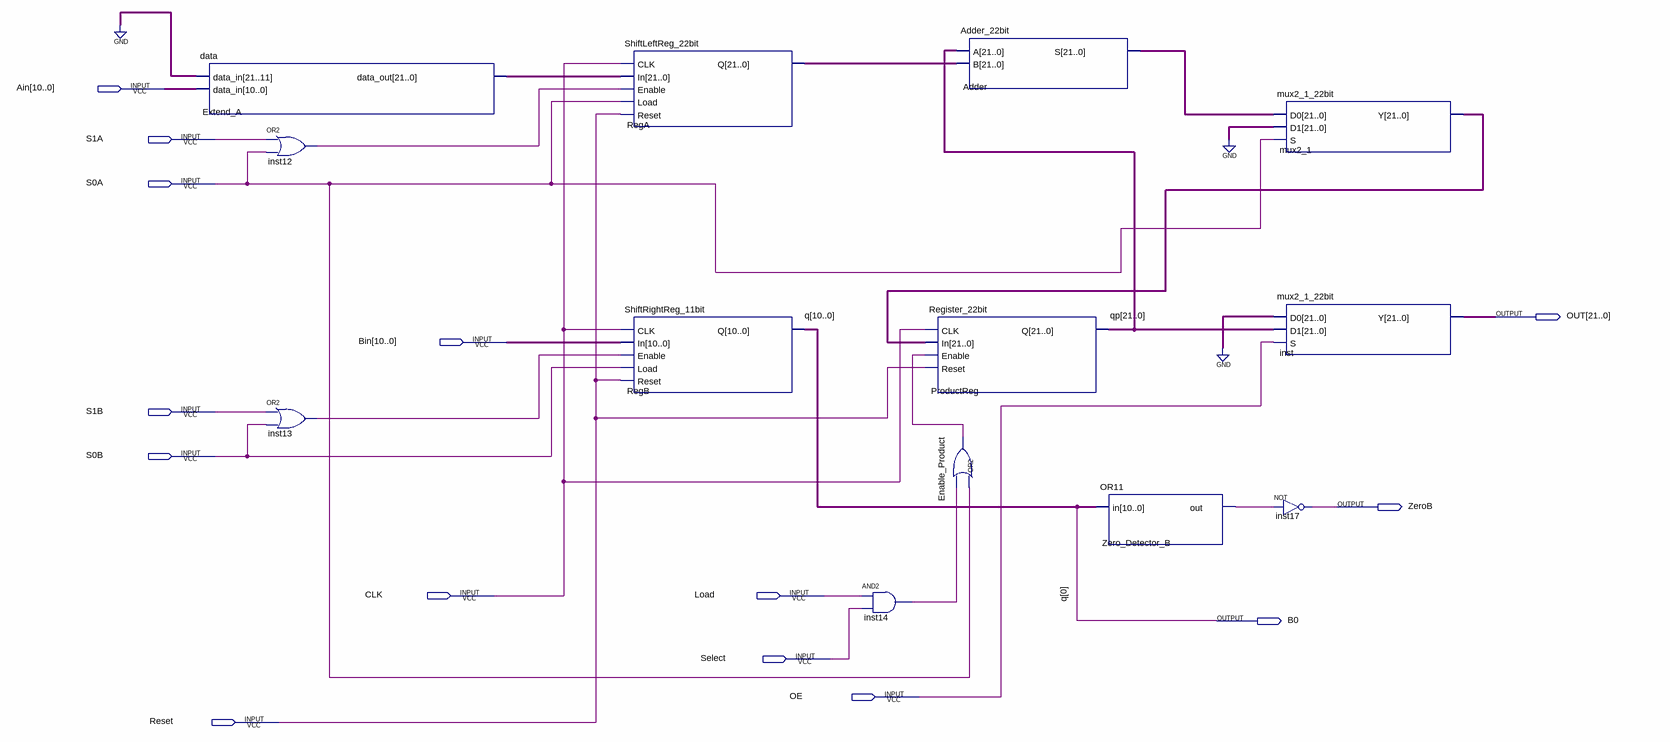
[diagram p0: schematic sheet]
// Quartus schematic Datapath_Mul.bdf as structural Verilog: 13 symbols, 14 pins
module Datapath_Mul (
  input  [10:0] Ain,
  input  S1A,
  input  S0A,
  input  [10:0] Bin,
  input  S1B,
  input  S0B,
  input  CLK,
  input  Load,
  input  Select,
  input  OE,
  input  Reset,
  output [21:0] OUT,
  output ZeroB,
  output B0
);

  wire Enable_Product_out, inst12_out, inst13_out, inst14_out, Zero_Detector_B_out;
  wire [10:1] q;
  wire [21:0] Adder_s, Extend_A_data_out, mux2_1_y, qp, RegA_q;

  data Extend_A (.data_in({{11{1'b0}}, Ain}), .data_out(Extend_A_data_out));
  or inst12 (inst12_out, S1A, S0A);
  or inst13 (inst13_out, S1B, S0B);
  ShiftLeftReg_22bit RegA (
    .CLK(CLK), .In(Extend_A_data_out), .Enable(inst12_out), .Load(S0A), .Reset(Reset), .Q(RegA_q));
  ShiftRightReg_11bit RegB (.CLK(CLK), .In(Bin), .Enable(inst13_out), .Load(S0B), .Reset(Reset), .Q({q, B0}));
  and inst14 (inst14_out, Load, Select);
  Register_22bit ProductReg (.CLK(CLK), .In(mux2_1_y), .Enable(Enable_Product_out), .Reset(Reset), .Q(qp));
  Adder_22bit Adder (.A(qp), .B(RegA_q), .S(Adder_s));
  or Enable_Product (Enable_Product_out, S0A, inst14_out);
  OR11 Zero_Detector_B (.in({q, B0}), .out(Zero_Detector_B_out));
  mux2_1_22bit mux2_1 (.D0(Adder_s), .D1({22{1'b0}}), .S(S0A), .Y(mux2_1_y));
  mux2_1_22bit inst (.D0({22{1'b0}}), .D1(qp), .S(OE), .Y(OUT));
  not inst17 (ZeroB, Zero_Detector_B_out);

  // Other names for the same wires on the sheet: q[0] = B0
endmodule
